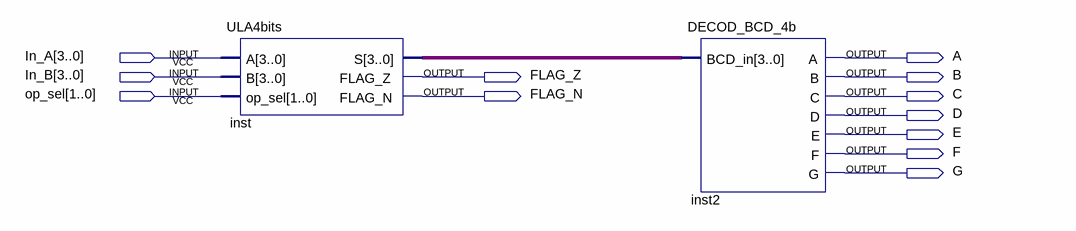
[diagram p0: schematic sheet]
// Quartus schematic ULA_DECOD_BCD.bdf as structural Verilog: 2 symbols, 12 pins
module ULA_DECOD_BCD (
  input  [3:0] In_A,
  input  [3:0] In_B,
  input  [1:0] op_sel,
  output A,
  output FLAG_Z,
  output B,
  output FLAG_N,
  output C,
  output D,
  output E,
  output F,
  output G
);

  wire [3:0] inst_s;

  ULA4bits inst (.A(In_A), .B(In_B), .op_sel(op_sel), .S(inst_s), .FLAG_Z(FLAG_Z), .FLAG_N(FLAG_N));
  DECOD_BCD_4b inst2 (.BCD_in(inst_s), .A(A), .B(B), .C(C), .D(D), .E(E), .F(F), .G(G));
endmodule
